# Altium schematic sheet SWR Tandem Match.SchDoc: SWR Tandem Match
size A4; DocumentNumber: 18; Revision: 2.0; SheetNumber: 18; SheetTotal: 18
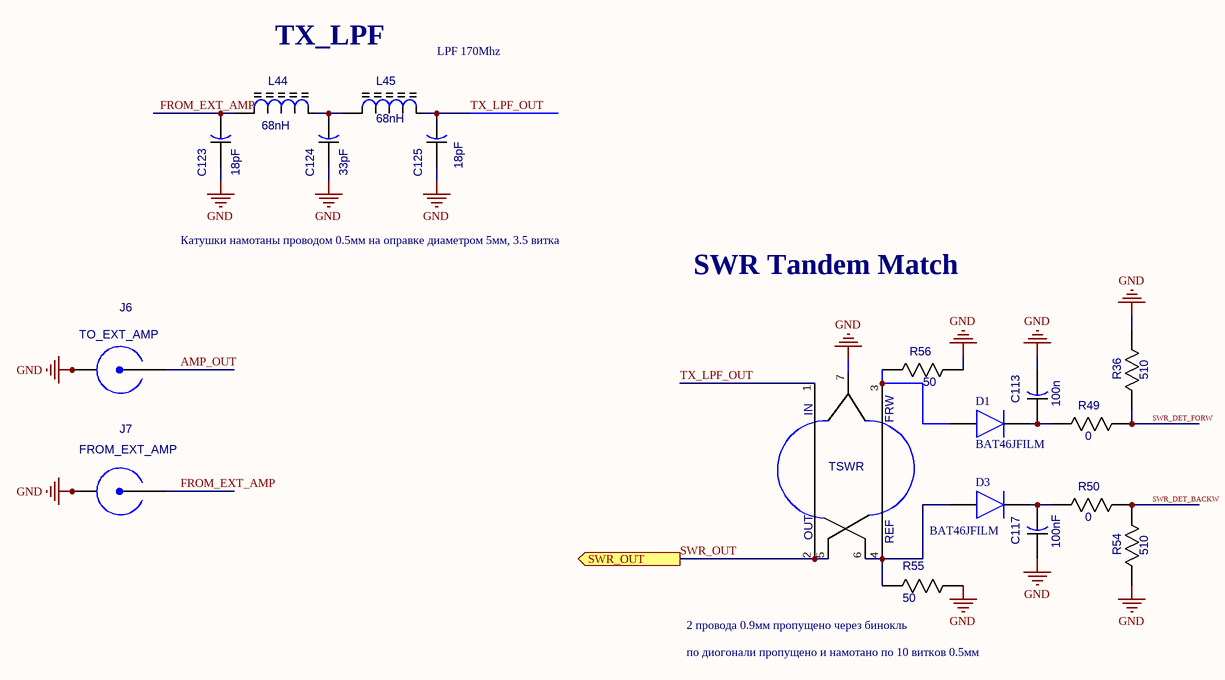
[diagram p0: SWR Tandem Match.SchDoc]

## Parts
C113  100n  [CAP_0805]
C117  100nF  [CAP_0805]
C123  18pF  [CAP_1206]
C124  33pF  [CAP_1206]
C125  18pF  [CAP_1206]
D1  BAT46JFILM  [SOD2513X117N]
D3  BAT46JFILM  [SOD2513X117N]
J6  TO_EXT_AMP  [31-5431]
J7  FROM_EXT_AMP  [31-5431]
L44  68nH  [IND_FERRITE_CORE_1]
L45  68nH  [IND_FERRITE_CORE_1]
R36  510  [RES_0805]
R49  0  [RES_0805]
R50  0  [RES_0805]
R54  510  [RES_0805]
R55  50  [RES_1206]
R56  50  [RES_1206]
TSWR  SWR_TANDEM_MATCH  [SWR_TANDEM_MATCH]  (value not drawn)

## Ports
SWR_OUT (out)

## Nets
GND: C113.2 C117.1 C123.1 C124.1 C125.1 J6.1(GND) J6.2(GND) J6.3(GND) J6.4(GND) J7.1(GND) J7.2(GND) J7.3(GND) J7.4(GND) R36.2 R54.1 R55.2 R56.2 TSWR.7
AMP_OUT: J6.5(CON)
FROM_EXT_AMP: C123.2 J7.5(CON) L44.1(A)
SWR_DET_BACKW: R50.2 R54.2
SWR_DET_FORW: R36.1 R49.2
SWR_OUT: TSWR.2 TSWR.5 ; port SWR_OUT
TX_LPF_OUT: C125.2 L45.2(B) TSWR.1
NetC113_1: C113.1 D1.1(K) R49.1
NetC117_2: C117.2 D3.1(K) R50.1
NetC124_2: C124.2 L44.2(B) L45.1(A)
NetD1_2: D1.2(A) R56.1 TSWR.3
NetD3_2: D3.2(A) R55.1 TSWR.4 TSWR.6

## Notes on the sheet
- TX_LPF
- LPF 170Mhz
- Катушки намотаны проводом 0.5мм на оправке диаметром 5мм, 3.5 витка
- SWR Tandem Match
- (near R55) 2 провода 0.9мм пропущено через бинокль
- по диогонали пропущено и намотано по 10 витков 0.5мм
- Title
- Size:
- Date:
- A4
- Number:
- Time:
- Revision:
- Sheet
- of
- File:
- (in symbol SWR_TANDEM_MATCH) IN; FRW; OUT; REF

## Library data of the parts
C113 C117 = CAP_0805
  C113: Value: 100n
  C117: Value: 100nF
C123-C125 = CAP_1206
D1 D3 = BAT46JFILM: Diode; Manufacturer_Name: STMicroelectronics; Allied_Number: 70389791; Datasheet Link: http://www.st.com/web/en/resource/technical/document/datasheet/CD00004930.pdf; Height: 1.17mm; Manufacturer_Part_Number: BAT46JFILM; Mouser Part Number: 511-BAT46JFILM; Mouser Price/Stock: https://www.mouser.co.uk/ProductDetail/STMicroelectronics/BAT46JFILM?qs=69%252BgXnvv5lrVjJqgcSQKbQ%3D%3D; RS Part Number: 7146847P; RS Price/Stock: http://uk.rs-online.com/web/p/products/7146847P; Allied Price/Stock: http://www.alliedelec.com/stmicroelectronics-bat46jfilm/70389791/
J6 J7 = 31-5431: SMA
L44 L45 = IND_FERRITE_CORE: Inductor
R36 R49 R50 R54 = RES_0805
  R36 R54: Value: 510
R55 R56 = RES_1206